# Altium project RPi_DAQ_Hat.PrjPcb
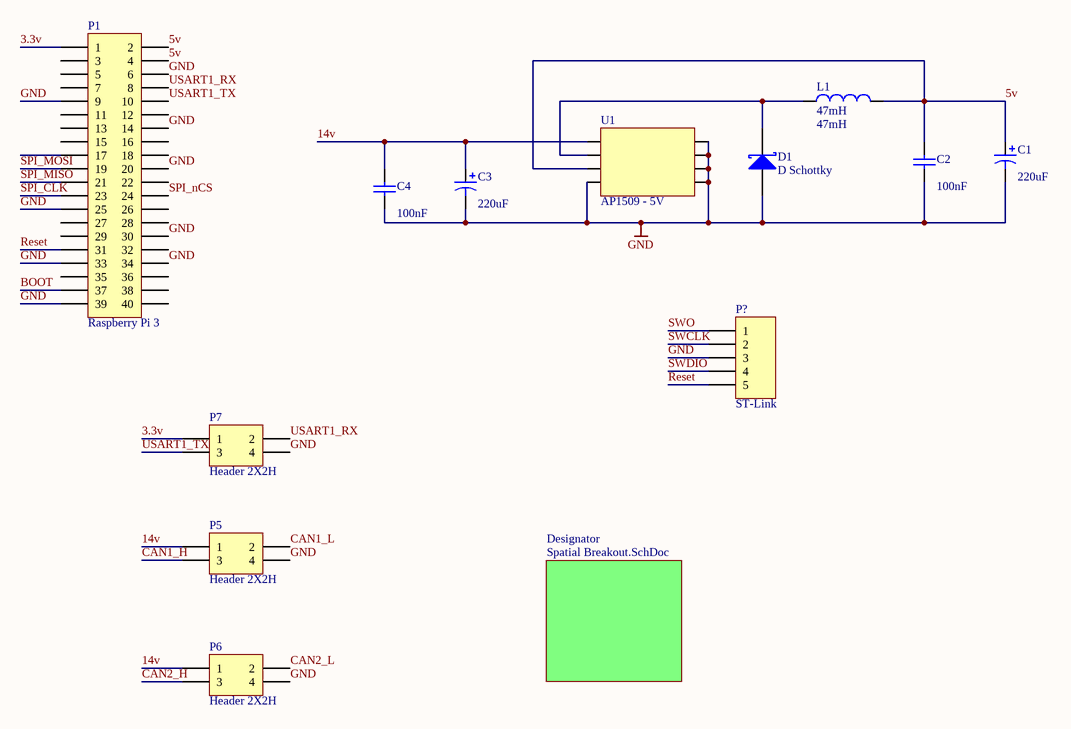
[diagram p0: RPi_DAQ_Hat_Connections.SchDoc]
5 sheets, 27 parts. Net scope: global (net labels, ports and power ports of the same name join across sheets).
Board file: RPi_DAQ_Hat.PcbDoc
Sheets:
  RPi_DAQ_Hat_Connections.SchDoc
  RPi_DAQ_Hat_MCU.SchDoc
  RPi_DAQ_Hat_InputConditioning1.SchDoc
  RPi_DAQ_Hat_InputConditioning3.SchDoc
  RPi_DAQ_Hat_InputConditioning2.SchDoc

## Sheet RPi_DAQ_Hat_Connections.SchDoc
size A

### Parts
C1  220uF  [SMD Capacitor 220uF 16V]
C2  100nF  [6-0805_N]
C3  220uF  [SMD Capacitor 220uF 16V]
C4  100nF  [6-0805_L]
D1  D Schottky  [Diode]
L1  47mH  [Inductor]
P1  Raspberry Pi 3  [Rasberry Pi 3 Hat]
P5  Header 2X2H  [SMD 4Wire]
P6  Header 2X2H  [SMD 4Wire]
P7  Header 2X2H  [SMD 4Wire]
P?  ST-Link  [SMD 5Wire]
U1  AP1509 - 5V  [SOP8]

### Sub-sheets
Designator = Spatial Breakout.SchDoc (file not in this document): no entries

### Nets
GND: C1.2 C2.1 C3.2 C4.1 D1.1(A) P1.6 P1.9 P1.14 P1.20 P1.25 P1.30 P1.33 P1.34 P1.39 P5.4 P6.4 P7.4 P?.3 U1.4 U1.5 U1.6 U1.7 U1.8
3.3v: P1.1 P7.1
5v: C1.1 C2.2 L1.2 P1.2 P1.4 U1.3
14v: C3.1 C4.2 P5.1 P6.1 U1.1
BOOT: P1.37
CAN1_H: P5.3
CAN1_L: P5.2
CAN2_H: P6.3
CAN2_L: P6.2
Reset: P1.31 P?.5
SPI_CLK: P1.23
SPI_MISO: P1.21
SPI_MOSI: P1.19
SPI_nCS: P1.24
SWCLK: P?.2
SWDIO: P?.4
SWO: P?.1
USART1_RX: P1.8 P7.2
USART1_TX: P1.10 P7.3
NetD1_2: D1.2(K) L1.1 U1.2

Not connected (* = marked no-connect by the designer): P1 3 5 7 11 12 13 15 16 17 18 22 26 27 28 29 32 35 36 38 40

### Library data of the parts
C1 C3 = Cap Pol1: Polarized Capacitor (Radial); Manufacturer: PANASONIC ELECTRONIC COMPONENTS; Manufacturer Part Number: EEE-FPA221XAP; Published: 8-Jun-2000; LatestRevisionDate: 17-Jul-2002; LatestRevisionNote: Re-released for DXP Platform.; PackageReference: RB7.6-15; Publisher: Altium Limited; PackageDescription: Polarized Capacitor (Radial); 2 Leads; Value: 220uF; Supplier 1: Newark; Supplier Part Number 1: 94M6987; RoHS: YES; Stock 1: 0; Pricing 1: 1=0.965, 10=0.796, 25=0.654, 50=0.571, 100=0.498, 250=0.392 (USD); ComponentLink1URL: http://www.farnell.com/datasheets/370232.pdf; ComponentLink1Description: http://www.farnell.com/datasheets/370232.pdf; ComponentLink2URL: http://www.farnell.com/cad/1703920.zip; ComponentLink2Description: http://www.farnell.com/cad/1703920.zip
C2 C4 = Cap: Capacitor; Manufacturer: KEMET; Manufacturer Part Number: C0805C104K5RACTU; Published: 8-Jun-2000; LatestRevisionDate: 17-Jul-2002; LatestRevisionNote: Re-released for DXP Platform.; PackageReference: RAD-0.3; Publisher: Altium Limited; PackageDescription: Radial Cap, Thru-Hole; 2 Leads; 0.3 in Pin Spacing; Value: 100nF; Supplier 1: Newark; Supplier Part Number 1: 65H7431; RoHS: YES; Stock 1: 584000; Pricing 1: 4000=0.008, 8000=0.006, 12000=0.006, 28000=0.005 (USD); ComponentLink1URL: http://www.farnell.com/cad/1558681.zip; ComponentLink1Description: http://www.farnell.com/cad/1558681.zip; ComponentLink2URL: http://www.farnell.com/datasheets/1828800.pdf; ComponentLink2Description: http://www.farnell.com/datasheets/1828800.pdf; ComponentLink3URL: http://www.kemet.com/kemet/web/homepage/kechome.nsf/file/Commercial%20Ceramic%20Chips%20X7R%20Dielectric/$file/F3102_X7R.pdf; ComponentLink3Description: http://www.kemet.com/kemet/web/homepage/kechome.nsf/file/Commercial%20Ceramic%20Chips%20X7R%20Dielectric/$file/F3102_X7R.pdf
D1 = D Schottky: Schottky Diode; Published: 8-Jun-2000; LatestRevisionDate: 17-Jul-2002; LatestRevisionNote: Re-released for DXP Platform.; PackageReference: SMB; Publisher: Altium Limited; PackageDescription: DO-214-AA/SMB; 2 C-Bend Leads; Body 5.3 x 3.6 mm, inc. leads (LxW); Code_JEDEC: DO-214-AA
L1 = Inductor: Manufacturer: Murata - TOKO; Manufacturer Part Number: 1255AY-470M=P3; Code_IEC: 1005; Core Material: Ferrite; Inductance: 47 uH; Maximum DC Current: 1.4 A; Maximum DC Resistance: 252 mOhms; Shielding: Shielded; Tolerance: 20 %; Type: Ferrite Inductor; Test Frequency: 100 kHz; Product Status: New Product; Current Rating: 1.4A; DC Resistance (DCR): 252 mOhm Max; Frequency - Test: 100kHz; Published: 8-Jun-2000; LatestRevisionDate: 29-May-2009; LatestRevisionNote: IPC-7351 Footprint Added.; PackageReference: 0402-A; Publisher: Altium Limited; PackageDescription: Chip Inductor; Code_JEITA: 0402; Value: 47mH; Supplier 1: Mouser; RoHS: RoHS Compliant; Category: Fixed Inductors; Stock 1: 1938; Pricing 1: 1=0.752, 10=0.547, 100=0.387, 1500=0.286, 3000=0.261, 9000=0.253, 24000=0.245, 49500=0.235 (AUD); Height: 4.5 mm; Length: 6.3 mm; Packaging: Reel; Product: Inductors; Series: DG6045C; Termination Style: SMD/SMT; Width: 6.3 mm; Brand: Murata - TOKO; Mounting Style: SMD/SMT; RoHS - Mouser: Y; Minimum Order Quantity: 1; Reeling: True; ComponentLink1URL: http://www.mouser.com/ds/2/281/m_dg6045c-610991.pdf; ComponentLink1Description: http://www.mouser.com/ds/2/281/m_dg6045c-610991.pdf; Supplier 2: Digi-Key; Supplier Part Number 2: 490-10811-1-ND; Stock 2: 3431; Pricing 2: 1=0.67, 10=0.598, 25=0.5608, 50=0.4862, 100=0.4488, 250=0.42636, 500=0.38898, 750=0.34409 (AUD); Material - Core: Ferrite; Current - Saturation: -; Q @ Freq: -; Frequency - Self Resonant: -; Ratings: -; Operating Temperature: -; Mounting Type: Surface Mount; Package / Case: Nonstandard; Size / Dimension: 0.248" L x 0.248" W (6.30mm x 6.30mm); Height - Seated (Max): 0.177" (4.50mm); ComponentLink2URL: http://www.toko.co.jp/products-murata/pdf/inductors/m_dg6045c.pdf; ComponentLink2Description: http://www.toko.co.jp/products-murata/pdf/inductors/m_dg6045c.pdf
P1 = Header 20X2H: Header, 20-Pin, Dual row, Right Angle; LatestRevisionDate: 17-Jul-2002; LatestRevisionNote: Re-released for DXP Platform.; Publisher: Altium Limited
P5-P7 = Header 2X2H: Header, 2-Pin, Dual row, Right Angle; LatestRevisionDate: 17-Jul-2002; LatestRevisionNote: Re-released for DXP Platform.; Publisher: Altium Limited
P? = Header 5: Header, 5-Pin; LatestRevisionDate: 17-Jul-2002; LatestRevisionNote: Re-released for DXP Platform.; Publisher: Altium Limited
U1 = AP1509

## Sheet RPi_DAQ_Hat_MCU.SchDoc
size A
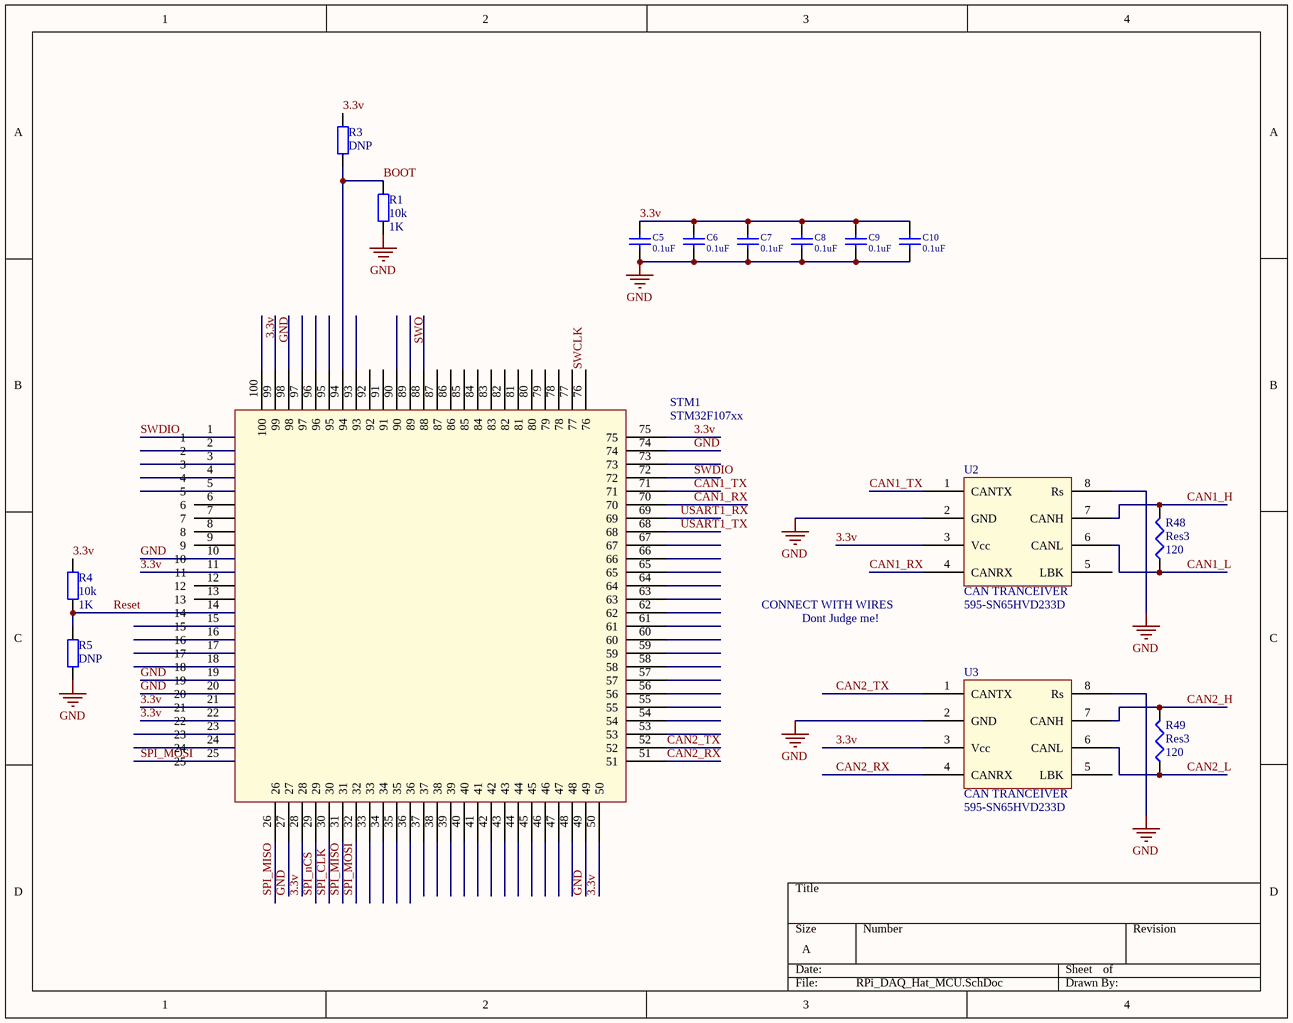
[diagram p1: RPi_DAQ_Hat_MCU.SchDoc]

### Parts
C5  0.1uF  [R0805]
C6  0.1uF  [R0805]
C7  0.1uF  [R0805]
C8  0.1uF  [R0805]
C9  0.1uF  [R0805]
C10  0.1uF  [R0805]
R1  10k  value 1K  [R0805]
R3  DNP  [R0805]
R4  10k  value 1K  [R0805]
R5  DNP  [R0805]
R48  Res3  value 120  [R0805]
R49  Res3  value 120  [R0805]
STM1  STM32F107xx  [LQFP100]
U2  CAN TRANCEIVER  Supplier Part Number 1: 595-SN65HVD233D  [SOP8]
U3  CAN TRANCEIVER  Supplier Part Number 1: 595-SN65HVD233D  [SOP8]

### Nets
GND: C5.2 C6.2 C7.2 C8.2 C9.2 C10.2 R1.1 R5.1 STM1.10 STM1.19 STM1.20 STM1.27 STM1.49 STM1.74 STM1.99 U2.2(GND) U2.8(Rs) U3.2(GND) U3.8(Rs)
3.3v: C5.1 C6.1 C7.1 C8.1 C9.1 C10.1 R3.2 R4.2 STM1.11 STM1.21 STM1.22 STM1.28 STM1.50 STM1.75 STM1.100 U2.3(Vcc) U3.3(Vcc)
BOOT: R1.2 R3.1 STM1.94
CAN1_H: R48.2 U2.7(CANH)
CAN1_L: R48.1 U2.6(CANL)
CAN1_RX: STM1.70 U2.4(CANRX)
CAN1_TX: STM1.71 U2.1(CANTX)
CAN2_H: R49.2 U3.7(CANH)
CAN2_L: R49.1 U3.6(CANL)
CAN2_RX: STM1.51 U3.4(CANRX)
CAN2_TX: STM1.52 U3.1(CANTX)
Reset: R4.1 R5.2 STM1.14
SPI_CLK: STM1.30
SPI_MISO: STM1.26 STM1.31
SPI_MOSI: STM1.25 STM1.32
SPI_nCS: STM1.29
SWCLK: STM1.76
SWDIO: STM1.1 STM1.72
SWO: STM1.89
USART1_RX: STM1.69
USART1_TX: STM1.68

Not connected (* = marked no-connect by the designer): STM1 2 3 4 5 6 7 8 9 12 13 15 16 17 18 23 24 33 34 35 36 37 38 39 40 41 42 43 44 45 46 47 48 53 54 55 56 57 58 59 60 61 62 63 64 65 66 67 73 77 78 79 80 81 82 83 84 85 86 87 88 90 91 92 93 95 96 97 98; U2 5(LBK); U3 5(LBK)

### Notes on the sheet
- CONNECT WITH WIRES
- Dont Judge me!

### Library data of the parts
C5-C10 = CAP_1: Capacitor; Supplier: FARNELL; Supplier Code: 317-287
R1 R4 = Res2: Resistor; Published: 8-Jun-2000; LatestRevisionDate: 17-Jul-2002; LatestRevisionNote: Re-released for DXP Platform.; PackageReference: AXIAL-0.4; Publisher: Altium Limited; PackageDescription: Axial Device, Thru-Hole; 2 Leads; 0.4 in Pin Spacing
R3 R5 = Res2: Resistor; Value: 1K; Published: 8-Jun-2000; LatestRevisionDate: 17-Jul-2002; LatestRevisionNote: Re-released for DXP Platform.; PackageReference: AXIAL-0.4; Publisher: Altium Limited; PackageDescription: Axial Device, Thru-Hole; 2 Leads; 0.4 in Pin Spacing
R48 R49 = Res3: Resistor; Published: 8-Jun-2000; LatestRevisionDate: 29-May-2009; LatestRevisionNote: IPC-7351 Footprint Added.; PackageReference: J1-0603; Publisher: Altium Limited; PackageDescription: Chip Resistor
U2 U3 = 595-SN65HVD233: Supplier 1: Mouser

## Sheet RPi_DAQ_Hat_InputConditioning1.SchDoc
size A

## Sheet RPi_DAQ_Hat_InputConditioning3.SchDoc
size A

## Sheet RPi_DAQ_Hat_InputConditioning2.SchDoc
size A

## Nets that join several sheets
GND: RPi_DAQ_Hat_Connections (23 pins), RPi_DAQ_Hat_MCU (19 pins)
3.3v: RPi_DAQ_Hat_Connections (P1.1 P7.1), RPi_DAQ_Hat_MCU (17 pins)
BOOT: RPi_DAQ_Hat_Connections (P1.37), RPi_DAQ_Hat_MCU (R1.2 R3.1 STM1.94)
CAN1_H: RPi_DAQ_Hat_Connections (P5.3), RPi_DAQ_Hat_MCU (R48.2 U2.7)
CAN1_L: RPi_DAQ_Hat_Connections (P5.2), RPi_DAQ_Hat_MCU (R48.1 U2.6)
CAN2_H: RPi_DAQ_Hat_Connections (P6.3), RPi_DAQ_Hat_MCU (R49.2 U3.7)
CAN2_L: RPi_DAQ_Hat_Connections (P6.2), RPi_DAQ_Hat_MCU (R49.1 U3.6)
Reset: RPi_DAQ_Hat_Connections (P1.31 P?.5), RPi_DAQ_Hat_MCU (R4.1 R5.2 STM1.14)
SPI_CLK: RPi_DAQ_Hat_Connections (P1.23), RPi_DAQ_Hat_MCU (STM1.30)
SPI_MISO: RPi_DAQ_Hat_Connections (P1.21), RPi_DAQ_Hat_MCU (STM1.26 STM1.31)
SPI_MOSI: RPi_DAQ_Hat_Connections (P1.19), RPi_DAQ_Hat_MCU (STM1.25 STM1.32)
SPI_nCS: RPi_DAQ_Hat_Connections (P1.24), RPi_DAQ_Hat_MCU (STM1.29)
SWCLK: RPi_DAQ_Hat_Connections (P?.2), RPi_DAQ_Hat_MCU (STM1.76)
SWDIO: RPi_DAQ_Hat_Connections (P?.4), RPi_DAQ_Hat_MCU (STM1.1 STM1.72)
SWO: RPi_DAQ_Hat_Connections (P?.1), RPi_DAQ_Hat_MCU (STM1.89)
USART1_RX: RPi_DAQ_Hat_Connections (P1.8 P7.2), RPi_DAQ_Hat_MCU (STM1.69)
USART1_TX: RPi_DAQ_Hat_Connections (P1.10 P7.3), RPi_DAQ_Hat_MCU (STM1.68)